# EAGLE schematic L3DCube_16x16_Base_Rev3 (EAGLE 7.2.0)
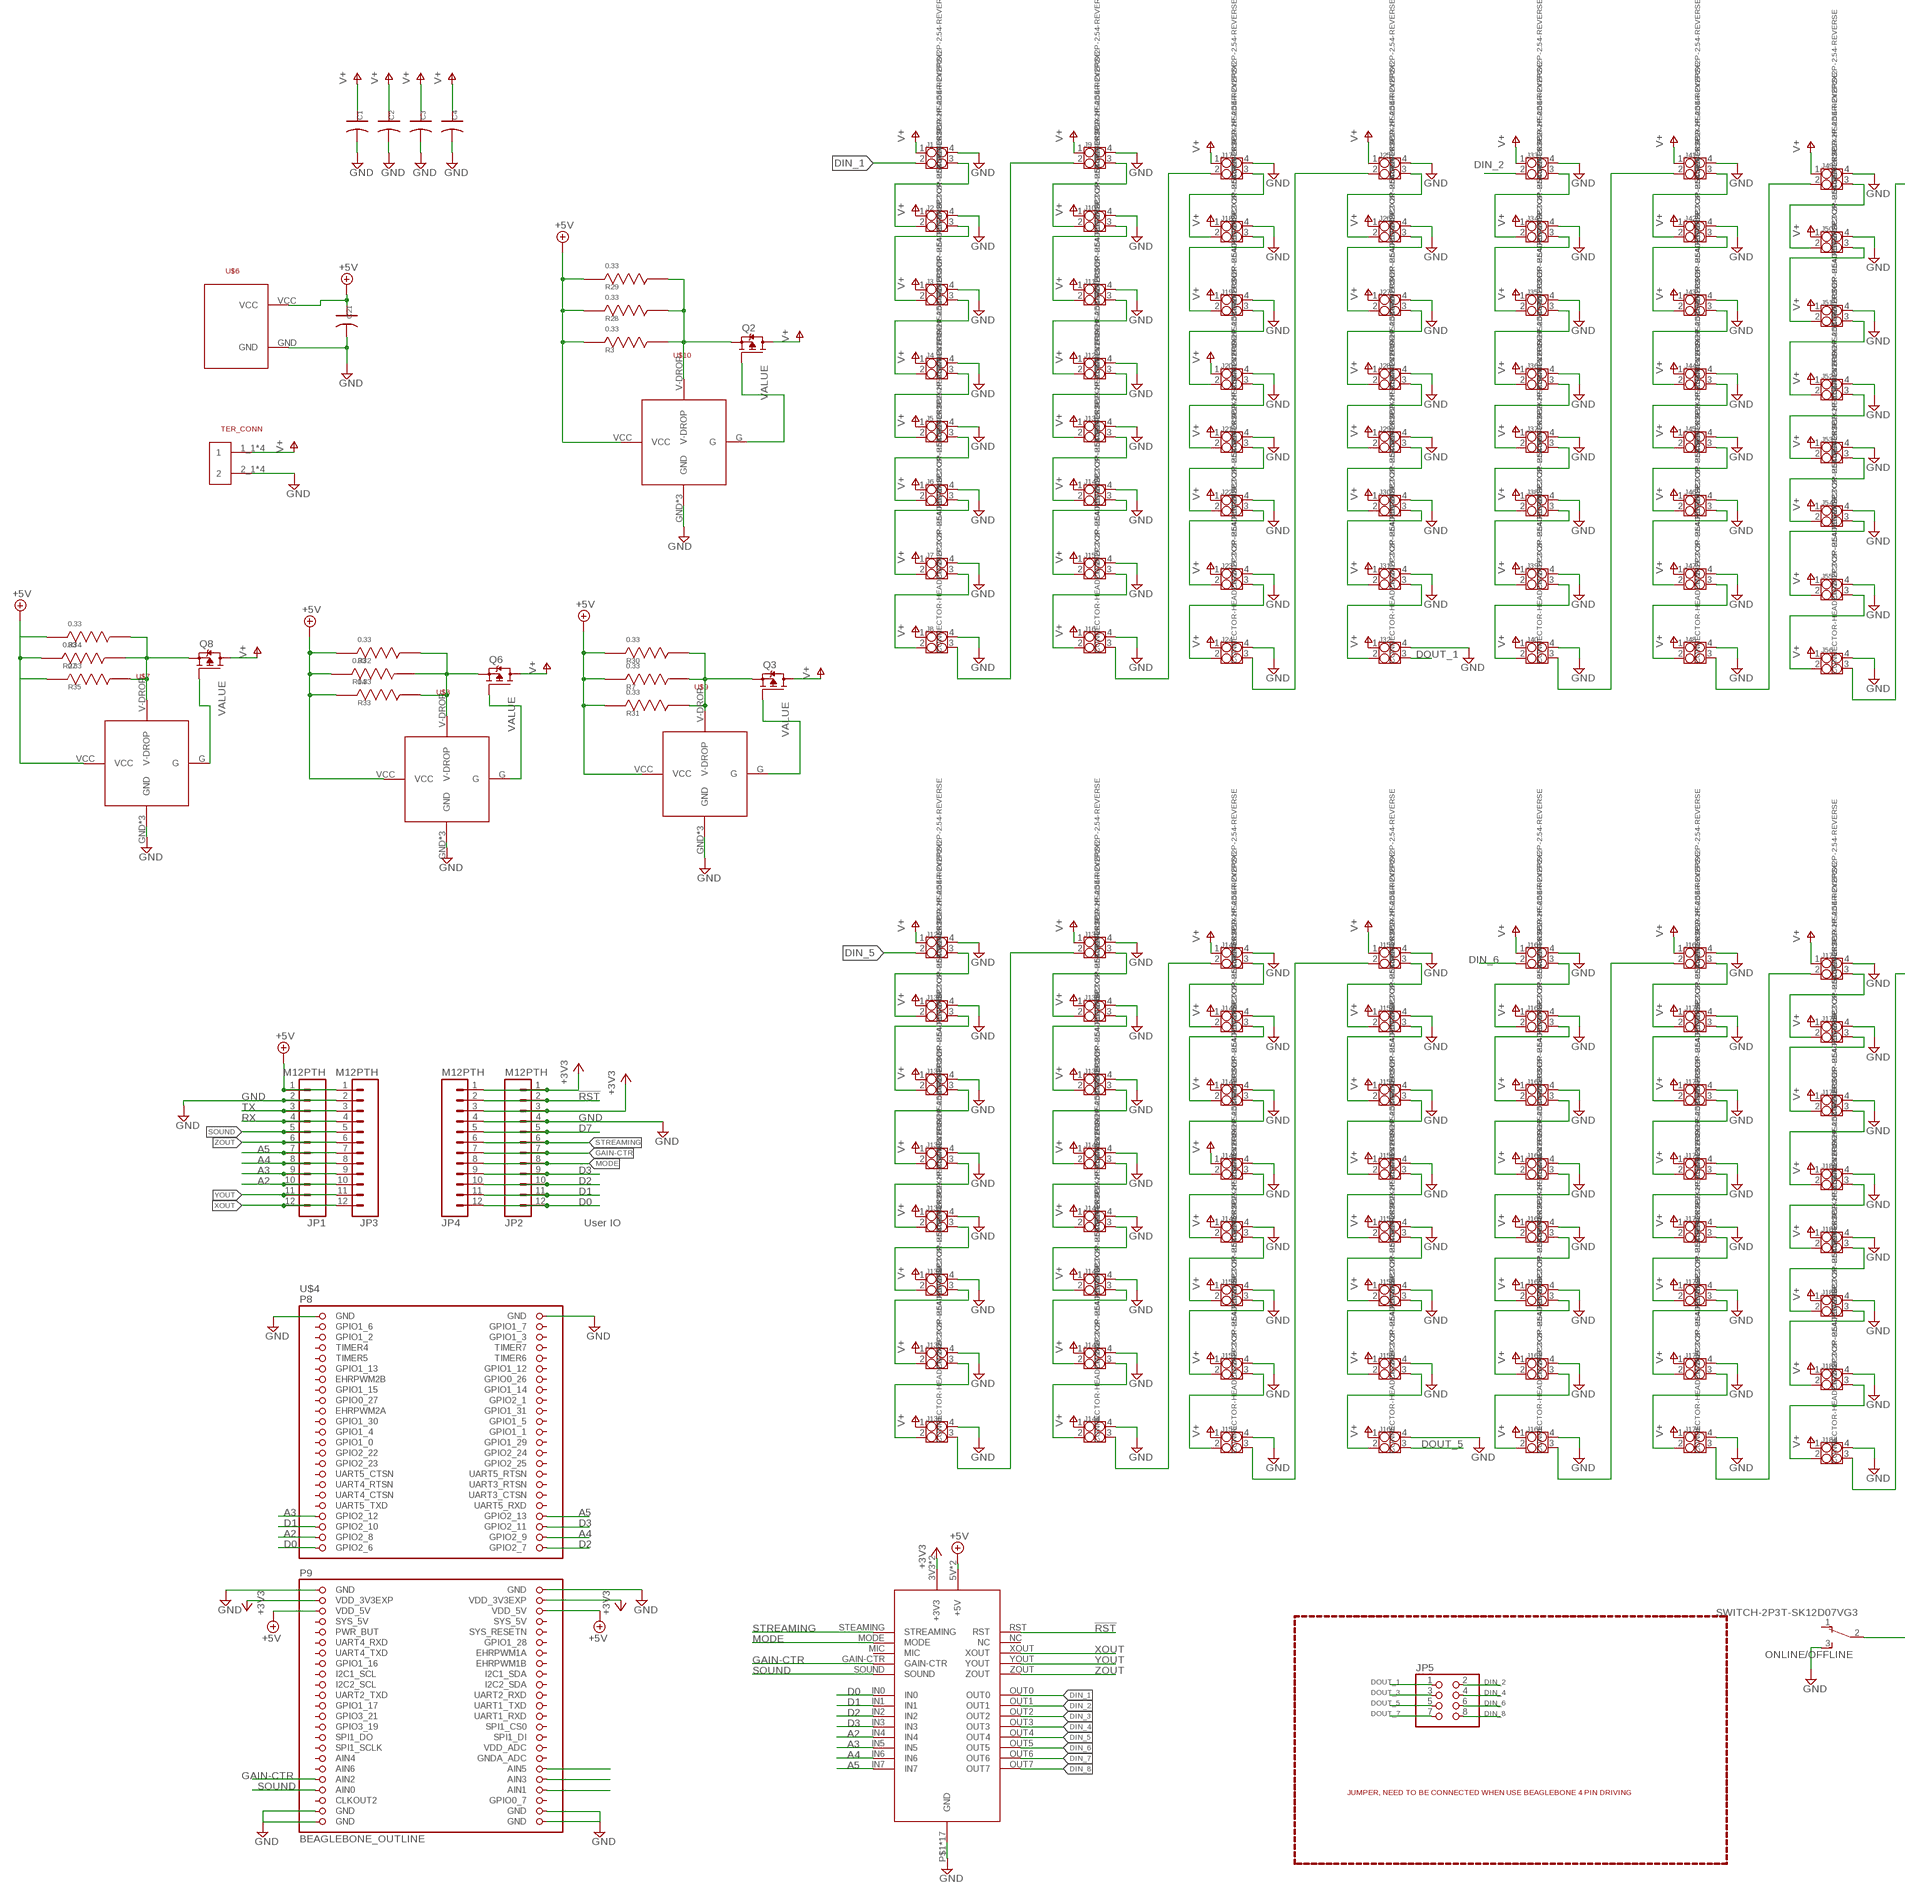
[diagram p0: schematic, sheet 1, part 1 of 2]
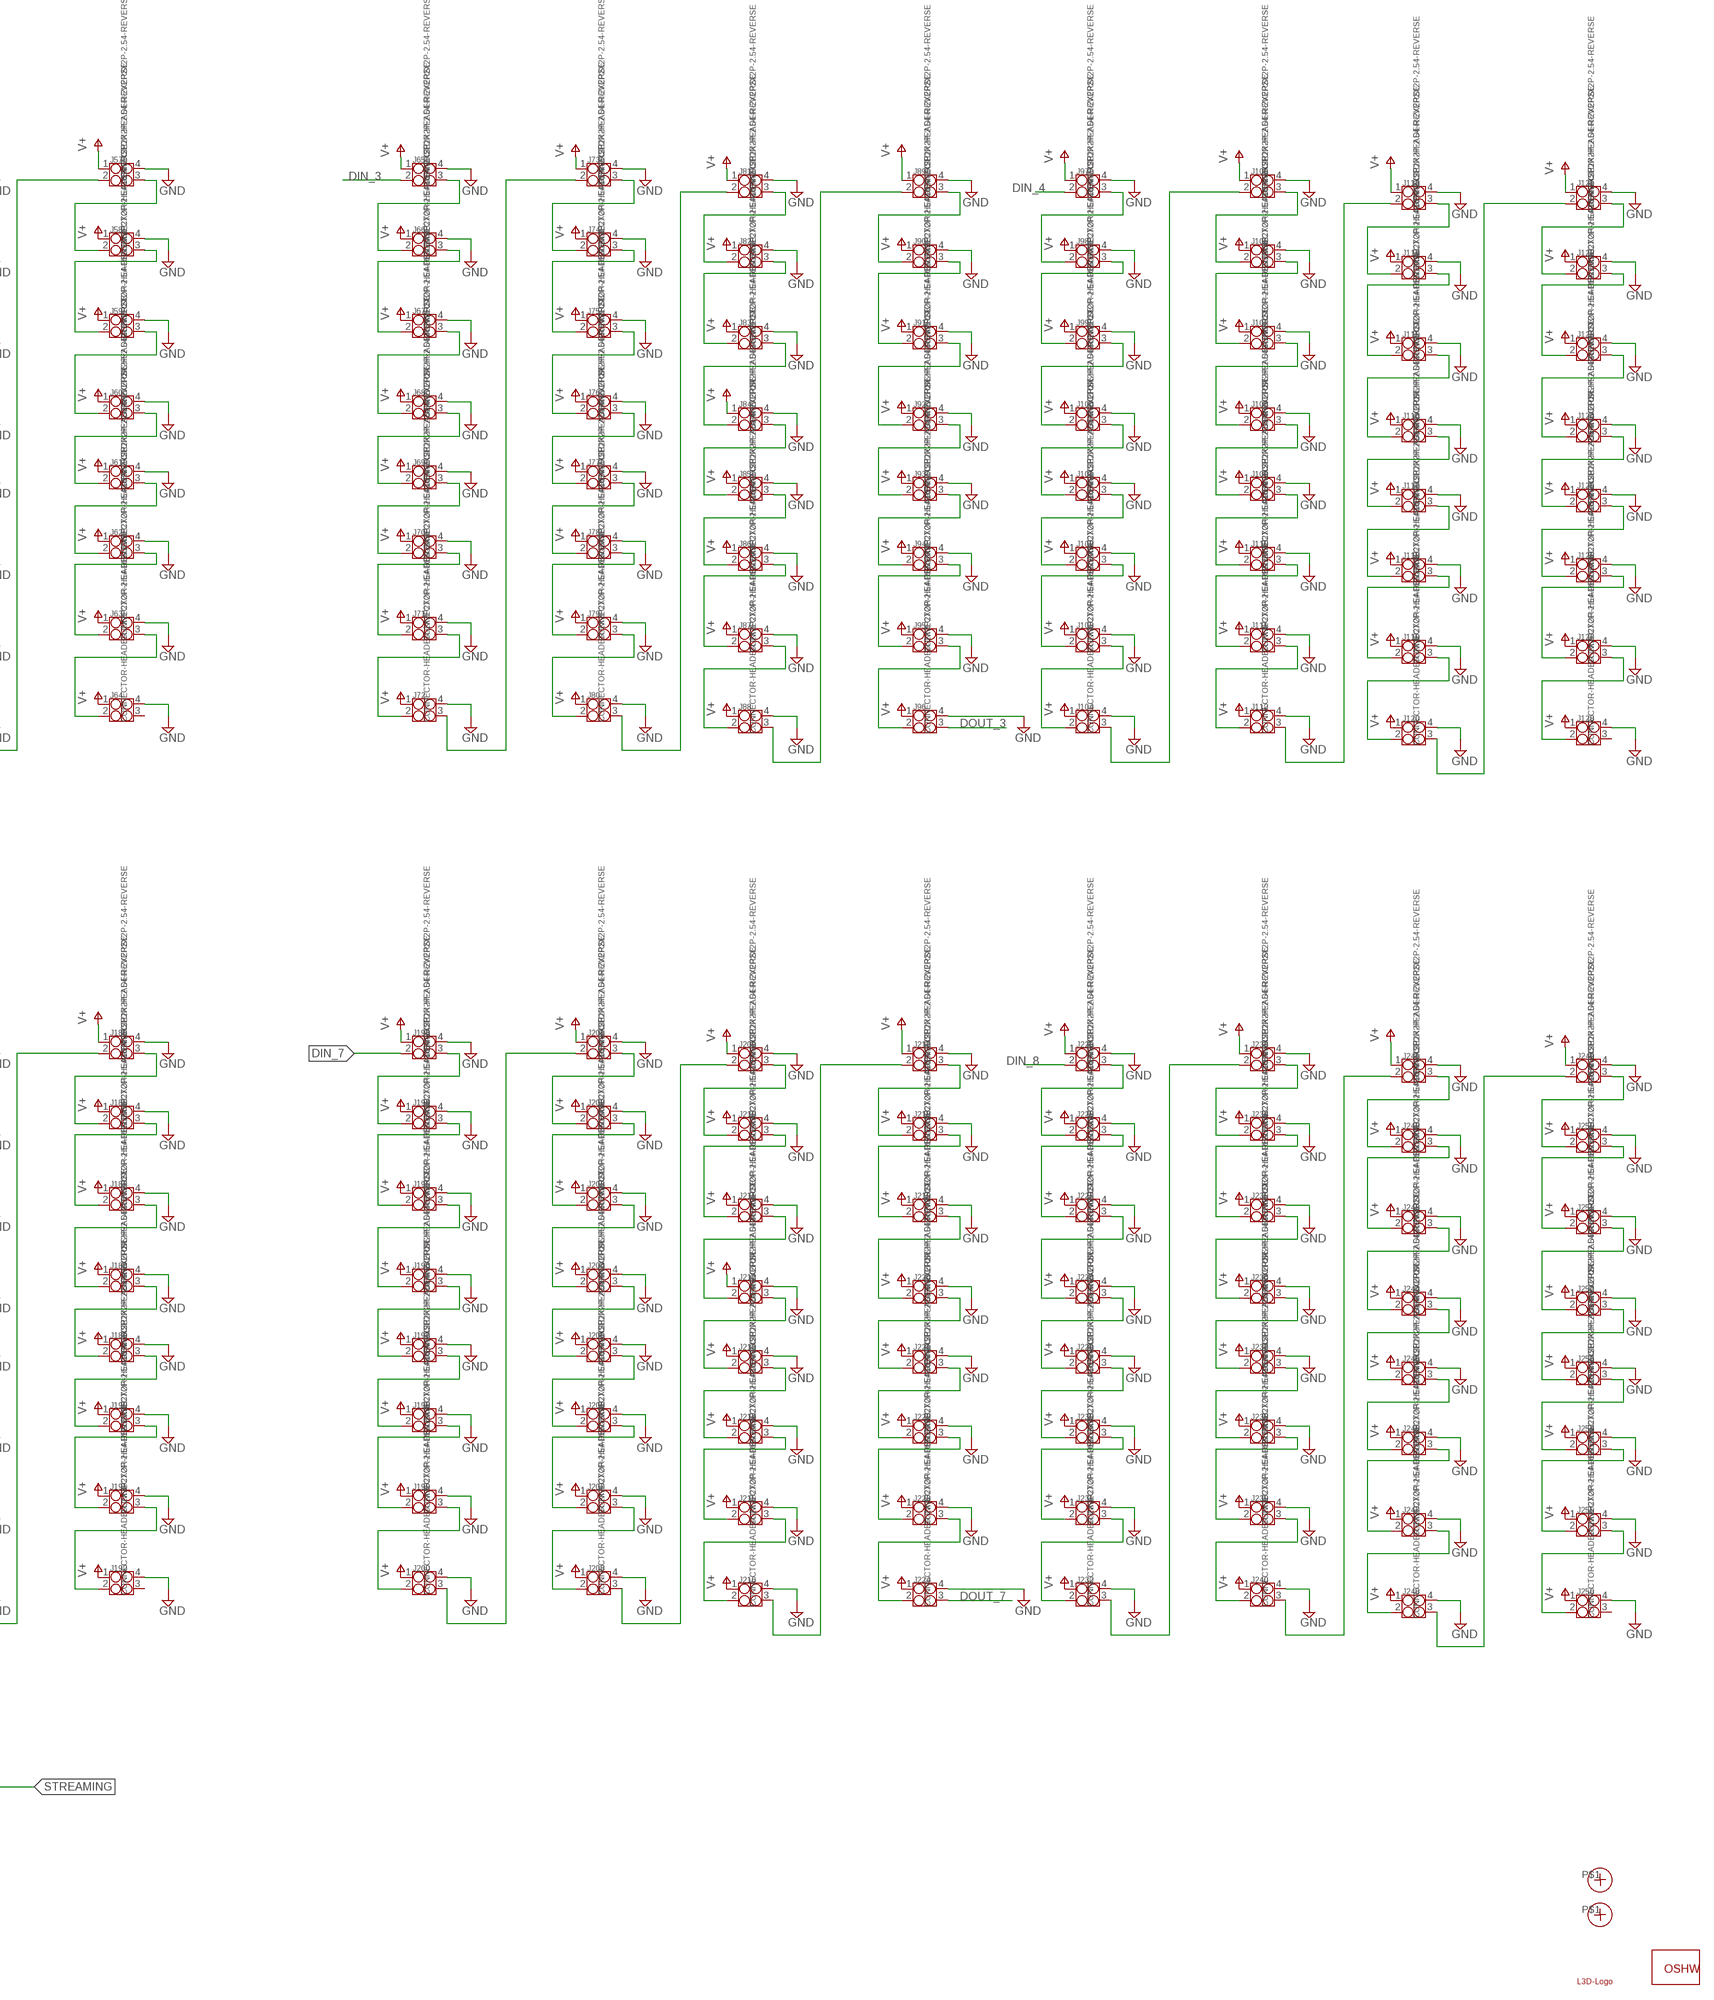
[diagram p1: schematic, sheet 1, part 2 of 2]

## Parts
C1  C-POLAR  [CAPACITOR-E3-8]
C2  C-POLAR  [CAPACITOR-E3-8]
C3  C-POLAR  [CAPACITOR-E3-8]
C4  C-POLAR  [CAPACITOR-E3-8]
C21  C-POLAR  [CAPACITOR-E3-8]
GOLD_ORB_SM1  OSHWLOGO_GOLD_ORB_LG  [OSHW0]
J1  CONNECTOR-HEADER-2X2P2X2P-2.54-REVERSE  [2X2P-2.54-REVERSE]
J2  CONNECTOR-HEADER-2X2P2X2P-2.54-REVERSE  [2X2P-2.54-REVERSE]
J3  CONNECTOR-HEADER-2X2P2X2P-2.54-REVERSE  [2X2P-2.54-REVERSE]
J4  CONNECTOR-HEADER-2X2P2X2P-2.54-REVERSE  [2X2P-2.54-REVERSE]
J5  CONNECTOR-HEADER-2X2P2X2P-2.54-REVERSE  [2X2P-2.54-REVERSE]
J6  CONNECTOR-HEADER-2X2P2X2P-2.54-REVERSE  [2X2P-2.54-REVERSE]
J7  CONNECTOR-HEADER-2X2P2X2P-2.54-REVERSE  [2X2P-2.54-REVERSE]
J8  CONNECTOR-HEADER-2X2P2X2P-2.54-REVERSE  [2X2P-2.54-REVERSE]
J9  CONNECTOR-HEADER-2X2P2X2P-2.54-REVERSE  [2X2P-2.54-REVERSE]
J10  CONNECTOR-HEADER-2X2P2X2P-2.54-REVERSE  [2X2P-2.54-REVERSE]
J11  CONNECTOR-HEADER-2X2P2X2P-2.54-REVERSE  [2X2P-2.54-REVERSE]
J12  CONNECTOR-HEADER-2X2P2X2P-2.54-REVERSE  [2X2P-2.54-REVERSE]
J13  CONNECTOR-HEADER-2X2P2X2P-2.54-REVERSE  [2X2P-2.54-REVERSE]
J14  CONNECTOR-HEADER-2X2P2X2P-2.54-REVERSE  [2X2P-2.54-REVERSE]
J15  CONNECTOR-HEADER-2X2P2X2P-2.54-REVERSE  [2X2P-2.54-REVERSE]
J16  CONNECTOR-HEADER-2X2P2X2P-2.54-REVERSE  [2X2P-2.54-REVERSE]
J17  CONNECTOR-HEADER-2X2P2X2P-2.54-REVERSE  [2X2P-2.54-REVERSE]
J18  CONNECTOR-HEADER-2X2P2X2P-2.54-REVERSE  [2X2P-2.54-REVERSE]
J19  CONNECTOR-HEADER-2X2P2X2P-2.54-REVERSE  [2X2P-2.54-REVERSE]
J20  CONNECTOR-HEADER-2X2P2X2P-2.54-REVERSE  [2X2P-2.54-REVERSE]
J21  CONNECTOR-HEADER-2X2P2X2P-2.54-REVERSE  [2X2P-2.54-REVERSE]
J22  CONNECTOR-HEADER-2X2P2X2P-2.54-REVERSE  [2X2P-2.54-REVERSE]
J23  CONNECTOR-HEADER-2X2P2X2P-2.54-REVERSE  [2X2P-2.54-REVERSE]
J24  CONNECTOR-HEADER-2X2P2X2P-2.54-REVERSE  [2X2P-2.54-REVERSE]
J25  CONNECTOR-HEADER-2X2P2X2P-2.54-REVERSE  [2X2P-2.54-REVERSE]
J26  CONNECTOR-HEADER-2X2P2X2P-2.54-REVERSE  [2X2P-2.54-REVERSE]
J27  CONNECTOR-HEADER-2X2P2X2P-2.54-REVERSE  [2X2P-2.54-REVERSE]
J28  CONNECTOR-HEADER-2X2P2X2P-2.54-REVERSE  [2X2P-2.54-REVERSE]
J29  CONNECTOR-HEADER-2X2P2X2P-2.54-REVERSE  [2X2P-2.54-REVERSE]
J30  CONNECTOR-HEADER-2X2P2X2P-2.54-REVERSE  [2X2P-2.54-REVERSE]
J31  CONNECTOR-HEADER-2X2P2X2P-2.54-REVERSE  [2X2P-2.54-REVERSE]
J32  CONNECTOR-HEADER-2X2P2X2P-2.54-REVERSE  [2X2P-2.54-REVERSE]
J33  CONNECTOR-HEADER-2X2P2X2P-2.54-REVERSE  [2X2P-2.54-REVERSE]
J34  CONNECTOR-HEADER-2X2P2X2P-2.54-REVERSE  [2X2P-2.54-REVERSE]
J35  CONNECTOR-HEADER-2X2P2X2P-2.54-REVERSE  [2X2P-2.54-REVERSE]
J36  CONNECTOR-HEADER-2X2P2X2P-2.54-REVERSE  [2X2P-2.54-REVERSE]
J37  CONNECTOR-HEADER-2X2P2X2P-2.54-REVERSE  [2X2P-2.54-REVERSE]
J38  CONNECTOR-HEADER-2X2P2X2P-2.54-REVERSE  [2X2P-2.54-REVERSE]
J39  CONNECTOR-HEADER-2X2P2X2P-2.54-REVERSE  [2X2P-2.54-REVERSE]
J40  CONNECTOR-HEADER-2X2P2X2P-2.54-REVERSE  [2X2P-2.54-REVERSE]
J41  CONNECTOR-HEADER-2X2P2X2P-2.54-REVERSE  [2X2P-2.54-REVERSE]
J42  CONNECTOR-HEADER-2X2P2X2P-2.54-REVERSE  [2X2P-2.54-REVERSE]
J43  CONNECTOR-HEADER-2X2P2X2P-2.54-REVERSE  [2X2P-2.54-REVERSE]
J44  CONNECTOR-HEADER-2X2P2X2P-2.54-REVERSE  [2X2P-2.54-REVERSE]
J45  CONNECTOR-HEADER-2X2P2X2P-2.54-REVERSE  [2X2P-2.54-REVERSE]
J46  CONNECTOR-HEADER-2X2P2X2P-2.54-REVERSE  [2X2P-2.54-REVERSE]
J47  CONNECTOR-HEADER-2X2P2X2P-2.54-REVERSE  [2X2P-2.54-REVERSE]
J48  CONNECTOR-HEADER-2X2P2X2P-2.54-REVERSE  [2X2P-2.54-REVERSE]
J49  CONNECTOR-HEADER-2X2P2X2P-2.54-REVERSE  [2X2P-2.54-REVERSE]
J50  CONNECTOR-HEADER-2X2P2X2P-2.54-REVERSE  [2X2P-2.54-REVERSE]
J51  CONNECTOR-HEADER-2X2P2X2P-2.54-REVERSE  [2X2P-2.54-REVERSE]
J52  CONNECTOR-HEADER-2X2P2X2P-2.54-REVERSE  [2X2P-2.54-REVERSE]
J53  CONNECTOR-HEADER-2X2P2X2P-2.54-REVERSE  [2X2P-2.54-REVERSE]
J54  CONNECTOR-HEADER-2X2P2X2P-2.54-REVERSE  [2X2P-2.54-REVERSE]
J55  CONNECTOR-HEADER-2X2P2X2P-2.54-REVERSE  [2X2P-2.54-REVERSE]
J56  CONNECTOR-HEADER-2X2P2X2P-2.54-REVERSE  [2X2P-2.54-REVERSE]
J57  CONNECTOR-HEADER-2X2P2X2P-2.54-REVERSE  [2X2P-2.54-REVERSE]
J58  CONNECTOR-HEADER-2X2P2X2P-2.54-REVERSE  [2X2P-2.54-REVERSE]
J59  CONNECTOR-HEADER-2X2P2X2P-2.54-REVERSE  [2X2P-2.54-REVERSE]
J60  CONNECTOR-HEADER-2X2P2X2P-2.54-REVERSE  [2X2P-2.54-REVERSE]
J61  CONNECTOR-HEADER-2X2P2X2P-2.54-REVERSE  [2X2P-2.54-REVERSE]
J62  CONNECTOR-HEADER-2X2P2X2P-2.54-REVERSE  [2X2P-2.54-REVERSE]
J63  CONNECTOR-HEADER-2X2P2X2P-2.54-REVERSE  [2X2P-2.54-REVERSE]
J64  CONNECTOR-HEADER-2X2P2X2P-2.54-REVERSE  [2X2P-2.54-REVERSE]
J65  CONNECTOR-HEADER-2X2P2X2P-2.54-REVERSE  [2X2P-2.54-REVERSE]
J66  CONNECTOR-HEADER-2X2P2X2P-2.54-REVERSE  [2X2P-2.54-REVERSE]
J67  CONNECTOR-HEADER-2X2P2X2P-2.54-REVERSE  [2X2P-2.54-REVERSE]
J68  CONNECTOR-HEADER-2X2P2X2P-2.54-REVERSE  [2X2P-2.54-REVERSE]
J69  CONNECTOR-HEADER-2X2P2X2P-2.54-REVERSE  [2X2P-2.54-REVERSE]
J70  CONNECTOR-HEADER-2X2P2X2P-2.54-REVERSE  [2X2P-2.54-REVERSE]
J71  CONNECTOR-HEADER-2X2P2X2P-2.54-REVERSE  [2X2P-2.54-REVERSE]
J72  CONNECTOR-HEADER-2X2P2X2P-2.54-REVERSE  [2X2P-2.54-REVERSE]
J73  CONNECTOR-HEADER-2X2P2X2P-2.54-REVERSE  [2X2P-2.54-REVERSE]
J74  CONNECTOR-HEADER-2X2P2X2P-2.54-REVERSE  [2X2P-2.54-REVERSE]
J75  CONNECTOR-HEADER-2X2P2X2P-2.54-REVERSE  [2X2P-2.54-REVERSE]
J76  CONNECTOR-HEADER-2X2P2X2P-2.54-REVERSE  [2X2P-2.54-REVERSE]
J77  CONNECTOR-HEADER-2X2P2X2P-2.54-REVERSE  [2X2P-2.54-REVERSE]
J78  CONNECTOR-HEADER-2X2P2X2P-2.54-REVERSE  [2X2P-2.54-REVERSE]
J79  CONNECTOR-HEADER-2X2P2X2P-2.54-REVERSE  [2X2P-2.54-REVERSE]
J80  CONNECTOR-HEADER-2X2P2X2P-2.54-REVERSE  [2X2P-2.54-REVERSE]
J81  CONNECTOR-HEADER-2X2P2X2P-2.54-REVERSE  [2X2P-2.54-REVERSE]
J82  CONNECTOR-HEADER-2X2P2X2P-2.54-REVERSE  [2X2P-2.54-REVERSE]
J83  CONNECTOR-HEADER-2X2P2X2P-2.54-REVERSE  [2X2P-2.54-REVERSE]
J84  CONNECTOR-HEADER-2X2P2X2P-2.54-REVERSE  [2X2P-2.54-REVERSE]
J85  CONNECTOR-HEADER-2X2P2X2P-2.54-REVERSE  [2X2P-2.54-REVERSE]
J86  CONNECTOR-HEADER-2X2P2X2P-2.54-REVERSE  [2X2P-2.54-REVERSE]
J87  CONNECTOR-HEADER-2X2P2X2P-2.54-REVERSE  [2X2P-2.54-REVERSE]
J88  CONNECTOR-HEADER-2X2P2X2P-2.54-REVERSE  [2X2P-2.54-REVERSE]
J89  CONNECTOR-HEADER-2X2P2X2P-2.54-REVERSE  [2X2P-2.54-REVERSE]
J90  CONNECTOR-HEADER-2X2P2X2P-2.54-REVERSE  [2X2P-2.54-REVERSE]
J91  CONNECTOR-HEADER-2X2P2X2P-2.54-REVERSE  [2X2P-2.54-REVERSE]
J92  CONNECTOR-HEADER-2X2P2X2P-2.54-REVERSE  [2X2P-2.54-REVERSE]
J93  CONNECTOR-HEADER-2X2P2X2P-2.54-REVERSE  [2X2P-2.54-REVERSE]
J94  CONNECTOR-HEADER-2X2P2X2P-2.54-REVERSE  [2X2P-2.54-REVERSE]
J95  CONNECTOR-HEADER-2X2P2X2P-2.54-REVERSE  [2X2P-2.54-REVERSE]
J96  CONNECTOR-HEADER-2X2P2X2P-2.54-REVERSE  [2X2P-2.54-REVERSE]
J97  CONNECTOR-HEADER-2X2P2X2P-2.54-REVERSE  [2X2P-2.54-REVERSE]
J98  CONNECTOR-HEADER-2X2P2X2P-2.54-REVERSE  [2X2P-2.54-REVERSE]
J99  CONNECTOR-HEADER-2X2P2X2P-2.54-REVERSE  [2X2P-2.54-REVERSE]
J100  CONNECTOR-HEADER-2X2P2X2P-2.54-REVERSE  [2X2P-2.54-REVERSE]
J101  CONNECTOR-HEADER-2X2P2X2P-2.54-REVERSE  [2X2P-2.54-REVERSE]
J102  CONNECTOR-HEADER-2X2P2X2P-2.54-REVERSE  [2X2P-2.54-REVERSE]
J103  CONNECTOR-HEADER-2X2P2X2P-2.54-REVERSE  [2X2P-2.54-REVERSE]
J104  CONNECTOR-HEADER-2X2P2X2P-2.54-REVERSE  [2X2P-2.54-REVERSE]
J105  CONNECTOR-HEADER-2X2P2X2P-2.54-REVERSE  [2X2P-2.54-REVERSE]
J106  CONNECTOR-HEADER-2X2P2X2P-2.54-REVERSE  [2X2P-2.54-REVERSE]
J107  CONNECTOR-HEADER-2X2P2X2P-2.54-REVERSE  [2X2P-2.54-REVERSE]
J108  CONNECTOR-HEADER-2X2P2X2P-2.54-REVERSE  [2X2P-2.54-REVERSE]
J109  CONNECTOR-HEADER-2X2P2X2P-2.54-REVERSE  [2X2P-2.54-REVERSE]
J110  CONNECTOR-HEADER-2X2P2X2P-2.54-REVERSE  [2X2P-2.54-REVERSE]
J111  CONNECTOR-HEADER-2X2P2X2P-2.54-REVERSE  [2X2P-2.54-REVERSE]
J112  CONNECTOR-HEADER-2X2P2X2P-2.54-REVERSE  [2X2P-2.54-REVERSE]
J113  CONNECTOR-HEADER-2X2P2X2P-2.54-REVERSE  [2X2P-2.54-REVERSE]
J114  CONNECTOR-HEADER-2X2P2X2P-2.54-REVERSE  [2X2P-2.54-REVERSE]
J115  CONNECTOR-HEADER-2X2P2X2P-2.54-REVERSE  [2X2P-2.54-REVERSE]
J116  CONNECTOR-HEADER-2X2P2X2P-2.54-REVERSE  [2X2P-2.54-REVERSE]
J117  CONNECTOR-HEADER-2X2P2X2P-2.54-REVERSE  [2X2P-2.54-REVERSE]
J118  CONNECTOR-HEADER-2X2P2X2P-2.54-REVERSE  [2X2P-2.54-REVERSE]
J119  CONNECTOR-HEADER-2X2P2X2P-2.54-REVERSE  [2X2P-2.54-REVERSE]
J120  CONNECTOR-HEADER-2X2P2X2P-2.54-REVERSE  [2X2P-2.54-REVERSE]
J121  CONNECTOR-HEADER-2X2P2X2P-2.54-REVERSE  [2X2P-2.54-REVERSE]
J122  CONNECTOR-HEADER-2X2P2X2P-2.54-REVERSE  [2X2P-2.54-REVERSE]
J123  CONNECTOR-HEADER-2X2P2X2P-2.54-REVERSE  [2X2P-2.54-REVERSE]
J124  CONNECTOR-HEADER-2X2P2X2P-2.54-REVERSE  [2X2P-2.54-REVERSE]
J125  CONNECTOR-HEADER-2X2P2X2P-2.54-REVERSE  [2X2P-2.54-REVERSE]
J126  CONNECTOR-HEADER-2X2P2X2P-2.54-REVERSE  [2X2P-2.54-REVERSE]
J127  CONNECTOR-HEADER-2X2P2X2P-2.54-REVERSE  [2X2P-2.54-REVERSE]
J128  CONNECTOR-HEADER-2X2P2X2P-2.54-REVERSE  [2X2P-2.54-REVERSE]
J129  CONNECTOR-HEADER-2X2P2X2P-2.54-REVERSE  [2X2P-2.54-REVERSE]
J130  CONNECTOR-HEADER-2X2P2X2P-2.54-REVERSE  [2X2P-2.54-REVERSE]
J131  CONNECTOR-HEADER-2X2P2X2P-2.54-REVERSE  [2X2P-2.54-REVERSE]
J132  CONNECTOR-HEADER-2X2P2X2P-2.54-REVERSE  [2X2P-2.54-REVERSE]
J133  CONNECTOR-HEADER-2X2P2X2P-2.54-REVERSE  [2X2P-2.54-REVERSE]
J134  CONNECTOR-HEADER-2X2P2X2P-2.54-REVERSE  [2X2P-2.54-REVERSE]
J135  CONNECTOR-HEADER-2X2P2X2P-2.54-REVERSE  [2X2P-2.54-REVERSE]
J136  CONNECTOR-HEADER-2X2P2X2P-2.54-REVERSE  [2X2P-2.54-REVERSE]
J137  CONNECTOR-HEADER-2X2P2X2P-2.54-REVERSE  [2X2P-2.54-REVERSE]
J138  CONNECTOR-HEADER-2X2P2X2P-2.54-REVERSE  [2X2P-2.54-REVERSE]
J139  CONNECTOR-HEADER-2X2P2X2P-2.54-REVERSE  [2X2P-2.54-REVERSE]
J140  CONNECTOR-HEADER-2X2P2X2P-2.54-REVERSE  [2X2P-2.54-REVERSE]
J141  CONNECTOR-HEADER-2X2P2X2P-2.54-REVERSE  [2X2P-2.54-REVERSE]
J142  CONNECTOR-HEADER-2X2P2X2P-2.54-REVERSE  [2X2P-2.54-REVERSE]
J143  CONNECTOR-HEADER-2X2P2X2P-2.54-REVERSE  [2X2P-2.54-REVERSE]
J144  CONNECTOR-HEADER-2X2P2X2P-2.54-REVERSE  [2X2P-2.54-REVERSE]
J145  CONNECTOR-HEADER-2X2P2X2P-2.54-REVERSE  [2X2P-2.54-REVERSE]
J146  CONNECTOR-HEADER-2X2P2X2P-2.54-REVERSE  [2X2P-2.54-REVERSE]
J147  CONNECTOR-HEADER-2X2P2X2P-2.54-REVERSE  [2X2P-2.54-REVERSE]
J148  CONNECTOR-HEADER-2X2P2X2P-2.54-REVERSE  [2X2P-2.54-REVERSE]
J149  CONNECTOR-HEADER-2X2P2X2P-2.54-REVERSE  [2X2P-2.54-REVERSE]
J150  CONNECTOR-HEADER-2X2P2X2P-2.54-REVERSE  [2X2P-2.54-REVERSE]
J151  CONNECTOR-HEADER-2X2P2X2P-2.54-REVERSE  [2X2P-2.54-REVERSE]
J152  CONNECTOR-HEADER-2X2P2X2P-2.54-REVERSE  [2X2P-2.54-REVERSE]
J153  CONNECTOR-HEADER-2X2P2X2P-2.54-REVERSE  [2X2P-2.54-REVERSE]
J154  CONNECTOR-HEADER-2X2P2X2P-2.54-REVERSE  [2X2P-2.54-REVERSE]
J155  CONNECTOR-HEADER-2X2P2X2P-2.54-REVERSE  [2X2P-2.54-REVERSE]
J156  CONNECTOR-HEADER-2X2P2X2P-2.54-REVERSE  [2X2P-2.54-REVERSE]
J157  CONNECTOR-HEADER-2X2P2X2P-2.54-REVERSE  [2X2P-2.54-REVERSE]
J158  CONNECTOR-HEADER-2X2P2X2P-2.54-REVERSE  [2X2P-2.54-REVERSE]
J159  CONNECTOR-HEADER-2X2P2X2P-2.54-REVERSE  [2X2P-2.54-REVERSE]
J160  CONNECTOR-HEADER-2X2P2X2P-2.54-REVERSE  [2X2P-2.54-REVERSE]
J161  CONNECTOR-HEADER-2X2P2X2P-2.54-REVERSE  [2X2P-2.54-REVERSE]
J162  CONNECTOR-HEADER-2X2P2X2P-2.54-REVERSE  [2X2P-2.54-REVERSE]
J163  CONNECTOR-HEADER-2X2P2X2P-2.54-REVERSE  [2X2P-2.54-REVERSE]
J164  CONNECTOR-HEADER-2X2P2X2P-2.54-REVERSE  [2X2P-2.54-REVERSE]
J165  CONNECTOR-HEADER-2X2P2X2P-2.54-REVERSE  [2X2P-2.54-REVERSE]
J166  CONNECTOR-HEADER-2X2P2X2P-2.54-REVERSE  [2X2P-2.54-REVERSE]
J167  CONNECTOR-HEADER-2X2P2X2P-2.54-REVERSE  [2X2P-2.54-REVERSE]
J168  CONNECTOR-HEADER-2X2P2X2P-2.54-REVERSE  [2X2P-2.54-REVERSE]
J169  CONNECTOR-HEADER-2X2P2X2P-2.54-REVERSE  [2X2P-2.54-REVERSE]
J170  CONNECTOR-HEADER-2X2P2X2P-2.54-REVERSE  [2X2P-2.54-REVERSE]
J171  CONNECTOR-HEADER-2X2P2X2P-2.54-REVERSE  [2X2P-2.54-REVERSE]
J172  CONNECTOR-HEADER-2X2P2X2P-2.54-REVERSE  [2X2P-2.54-REVERSE]
J173  CONNECTOR-HEADER-2X2P2X2P-2.54-REVERSE  [2X2P-2.54-REVERSE]
J174  CONNECTOR-HEADER-2X2P2X2P-2.54-REVERSE  [2X2P-2.54-REVERSE]
J175  CONNECTOR-HEADER-2X2P2X2P-2.54-REVERSE  [2X2P-2.54-REVERSE]
J176  CONNECTOR-HEADER-2X2P2X2P-2.54-REVERSE  [2X2P-2.54-REVERSE]
J177  CONNECTOR-HEADER-2X2P2X2P-2.54-REVERSE  [2X2P-2.54-REVERSE]
J178  CONNECTOR-HEADER-2X2P2X2P-2.54-REVERSE  [2X2P-2.54-REVERSE]
J179  CONNECTOR-HEADER-2X2P2X2P-2.54-REVERSE  [2X2P-2.54-REVERSE]
J180  CONNECTOR-HEADER-2X2P2X2P-2.54-REVERSE  [2X2P-2.54-REVERSE]
J181  CONNECTOR-HEADER-2X2P2X2P-2.54-REVERSE  [2X2P-2.54-REVERSE]
J182  CONNECTOR-HEADER-2X2P2X2P-2.54-REVERSE  [2X2P-2.54-REVERSE]
J183  CONNECTOR-HEADER-2X2P2X2P-2.54-REVERSE  [2X2P-2.54-REVERSE]
J184  CONNECTOR-HEADER-2X2P2X2P-2.54-REVERSE  [2X2P-2.54-REVERSE]
J185  CONNECTOR-HEADER-2X2P2X2P-2.54-REVERSE  [2X2P-2.54-REVERSE]
J186  CONNECTOR-HEADER-2X2P2X2P-2.54-REVERSE  [2X2P-2.54-REVERSE]
J187  CONNECTOR-HEADER-2X2P2X2P-2.54-REVERSE  [2X2P-2.54-REVERSE]
J188  CONNECTOR-HEADER-2X2P2X2P-2.54-REVERSE  [2X2P-2.54-REVERSE]
J189  CONNECTOR-HEADER-2X2P2X2P-2.54-REVERSE  [2X2P-2.54-REVERSE]
J190  CONNECTOR-HEADER-2X2P2X2P-2.54-REVERSE  [2X2P-2.54-REVERSE]
J191  CONNECTOR-HEADER-2X2P2X2P-2.54-REVERSE  [2X2P-2.54-REVERSE]
J192  CONNECTOR-HEADER-2X2P2X2P-2.54-REVERSE  [2X2P-2.54-REVERSE]
J193  CONNECTOR-HEADER-2X2P2X2P-2.54-REVERSE  [2X2P-2.54-REVERSE]
J194  CONNECTOR-HEADER-2X2P2X2P-2.54-REVERSE  [2X2P-2.54-REVERSE]
J195  CONNECTOR-HEADER-2X2P2X2P-2.54-REVERSE  [2X2P-2.54-REVERSE]
J196  CONNECTOR-HEADER-2X2P2X2P-2.54-REVERSE  [2X2P-2.54-REVERSE]
J197  CONNECTOR-HEADER-2X2P2X2P-2.54-REVERSE  [2X2P-2.54-REVERSE]
J198  CONNECTOR-HEADER-2X2P2X2P-2.54-REVERSE  [2X2P-2.54-REVERSE]
J199  CONNECTOR-HEADER-2X2P2X2P-2.54-REVERSE  [2X2P-2.54-REVERSE]
J200  CONNECTOR-HEADER-2X2P2X2P-2.54-REVERSE  [2X2P-2.54-REVERSE]
J201  CONNECTOR-HEADER-2X2P2X2P-2.54-REVERSE  [2X2P-2.54-REVERSE]
J202  CONNECTOR-HEADER-2X2P2X2P-2.54-REVERSE  [2X2P-2.54-REVERSE]
J203  CONNECTOR-HEADER-2X2P2X2P-2.54-REVERSE  [2X2P-2.54-REVERSE]
J204  CONNECTOR-HEADER-2X2P2X2P-2.54-REVERSE  [2X2P-2.54-REVERSE]
J205  CONNECTOR-HEADER-2X2P2X2P-2.54-REVERSE  [2X2P-2.54-REVERSE]
J206  CONNECTOR-HEADER-2X2P2X2P-2.54-REVERSE  [2X2P-2.54-REVERSE]
J207  CONNECTOR-HEADER-2X2P2X2P-2.54-REVERSE  [2X2P-2.54-REVERSE]
J208  CONNECTOR-HEADER-2X2P2X2P-2.54-REVERSE  [2X2P-2.54-REVERSE]
J209  CONNECTOR-HEADER-2X2P2X2P-2.54-REVERSE  [2X2P-2.54-REVERSE]
J210  CONNECTOR-HEADER-2X2P2X2P-2.54-REVERSE  [2X2P-2.54-REVERSE]
J211  CONNECTOR-HEADER-2X2P2X2P-2.54-REVERSE  [2X2P-2.54-REVERSE]
J212  CONNECTOR-HEADER-2X2P2X2P-2.54-REVERSE  [2X2P-2.54-REVERSE]
J213  CONNECTOR-HEADER-2X2P2X2P-2.54-REVERSE  [2X2P-2.54-REVERSE]
J214  CONNECTOR-HEADER-2X2P2X2P-2.54-REVERSE  [2X2P-2.54-REVERSE]
J215  CONNECTOR-HEADER-2X2P2X2P-2.54-REVERSE  [2X2P-2.54-REVERSE]
J216  CONNECTOR-HEADER-2X2P2X2P-2.54-REVERSE  [2X2P-2.54-REVERSE]
J217  CONNECTOR-HEADER-2X2P2X2P-2.54-REVERSE  [2X2P-2.54-REVERSE]
J218  CONNECTOR-HEADER-2X2P2X2P-2.54-REVERSE  [2X2P-2.54-REVERSE]
J219  CONNECTOR-HEADER-2X2P2X2P-2.54-REVERSE  [2X2P-2.54-REVERSE]
J220  CONNECTOR-HEADER-2X2P2X2P-2.54-REVERSE  [2X2P-2.54-REVERSE]
J221  CONNECTOR-HEADER-2X2P2X2P-2.54-REVERSE  [2X2P-2.54-REVERSE]
J222  CONNECTOR-HEADER-2X2P2X2P-2.54-REVERSE  [2X2P-2.54-REVERSE]
J223  CONNECTOR-HEADER-2X2P2X2P-2.54-REVERSE  [2X2P-2.54-REVERSE]
J224  CONNECTOR-HEADER-2X2P2X2P-2.54-REVERSE  [2X2P-2.54-REVERSE]
J225  CONNECTOR-HEADER-2X2P2X2P-2.54-REVERSE  [2X2P-2.54-REVERSE]
J226  CONNECTOR-HEADER-2X2P2X2P-2.54-REVERSE  [2X2P-2.54-REVERSE]
J227  CONNECTOR-HEADER-2X2P2X2P-2.54-REVERSE  [2X2P-2.54-REVERSE]
J228  CONNECTOR-HEADER-2X2P2X2P-2.54-REVERSE  [2X2P-2.54-REVERSE]
J229  CONNECTOR-HEADER-2X2P2X2P-2.54-REVERSE  [2X2P-2.54-REVERSE]
J230  CONNECTOR-HEADER-2X2P2X2P-2.54-REVERSE  [2X2P-2.54-REVERSE]
J231  CONNECTOR-HEADER-2X2P2X2P-2.54-REVERSE  [2X2P-2.54-REVERSE]
J232  CONNECTOR-HEADER-2X2P2X2P-2.54-REVERSE  [2X2P-2.54-REVERSE]
J233  CONNECTOR-HEADER-2X2P2X2P-2.54-REVERSE  [2X2P-2.54-REVERSE]
J234  CONNECTOR-HEADER-2X2P2X2P-2.54-REVERSE  [2X2P-2.54-REVERSE]
J235  CONNECTOR-HEADER-2X2P2X2P-2.54-REVERSE  [2X2P-2.54-REVERSE]
J236  CONNECTOR-HEADER-2X2P2X2P-2.54-REVERSE  [2X2P-2.54-REVERSE]
J237  CONNECTOR-HEADER-2X2P2X2P-2.54-REVERSE  [2X2P-2.54-REVERSE]
J238  CONNECTOR-HEADER-2X2P2X2P-2.54-REVERSE  [2X2P-2.54-REVERSE]
J239  CONNECTOR-HEADER-2X2P2X2P-2.54-REVERSE  [2X2P-2.54-REVERSE]
J240  CONNECTOR-HEADER-2X2P2X2P-2.54-REVERSE  [2X2P-2.54-REVERSE]
J241  CONNECTOR-HEADER-2X2P2X2P-2.54-REVERSE  [2X2P-2.54-REVERSE]
J242  CONNECTOR-HEADER-2X2P2X2P-2.54-REVERSE  [2X2P-2.54-REVERSE]
J243  CONNECTOR-HEADER-2X2P2X2P-2.54-REVERSE  [2X2P-2.54-REVERSE]
J244  CONNECTOR-HEADER-2X2P2X2P-2.54-REVERSE  [2X2P-2.54-REVERSE]
J245  CONNECTOR-HEADER-2X2P2X2P-2.54-REVERSE  [2X2P-2.54-REVERSE]
J246  CONNECTOR-HEADER-2X2P2X2P-2.54-REVERSE  [2X2P-2.54-REVERSE]
J247  CONNECTOR-HEADER-2X2P2X2P-2.54-REVERSE  [2X2P-2.54-REVERSE]
J248  CONNECTOR-HEADER-2X2P2X2P-2.54-REVERSE  [2X2P-2.54-REVERSE]
J249  CONNECTOR-HEADER-2X2P2X2P-2.54-REVERSE  [2X2P-2.54-REVERSE]
J250  CONNECTOR-HEADER-2X2P2X2P-2.54-REVERSE  [2X2P-2.54-REVERSE]
J251  CONNECTOR-HEADER-2X2P2X2P-2.54-REVERSE  [2X2P-2.54-REVERSE]
J252  CONNECTOR-HEADER-2X2P2X2P-2.54-REVERSE  [2X2P-2.54-REVERSE]
J253  CONNECTOR-HEADER-2X2P2X2P-2.54-REVERSE  [2X2P-2.54-REVERSE]
J254  CONNECTOR-HEADER-2X2P2X2P-2.54-REVERSE  [2X2P-2.54-REVERSE]
J255  CONNECTOR-HEADER-2X2P2X2P-2.54-REVERSE  [2X2P-2.54-REVERSE]
J256  CONNECTOR-HEADER-2X2P2X2P-2.54-REVERSE  [2X2P-2.54-REVERSE]
JP1  M12PTH  [1X12-SMALL-PADS]
JP2  M12PTH  [1X12-SMALL-PADS]
JP3  M12PTH  [1X12-SMALL-PADS]
JP4  M12PTH  [1X12-SMALL-PADS]
JP5  PINHD-2X4  [2X04]
ONLINE/OFFLINE  SWITCH-2P3T-SK12D07VG3  [SWITCH-2P3T-SK12D07VG3]
Q2  FDD6637  FDD4141TO252  [TO252]
Q3  FDD6637  FDD4141TO252  [TO252]
Q6  FDD6637  FDD4141TO252  [TO252]
Q8  FDD6637  FDD4141TO252  [TO252]
R3  0.33  RESISTOR-3W-20MM  [RESISTOR-3W-20MM]
R7  0.33  RESISTOR-3W-20MM  [RESISTOR-3W-20MM]
R14  0.33  RESISTOR-3W-20MM  [RESISTOR-3W-20MM]
R27  0.33  RESISTOR-3W-20MM  [RESISTOR-3W-20MM]
R28  0.33  RESISTOR-3W-20MM  [RESISTOR-3W-20MM]
R29  0.33  RESISTOR-3W-20MM  [RESISTOR-3W-20MM]
R30  0.33  RESISTOR-3W-20MM  [RESISTOR-3W-20MM]
R31  0.33  RESISTOR-3W-20MM  [RESISTOR-3W-20MM]
R32  0.33  RESISTOR-3W-20MM  [RESISTOR-3W-20MM]
R33  0.33  RESISTOR-3W-20MM  [RESISTOR-3W-20MM]
R34  0.33  RESISTOR-3W-20MM  [RESISTOR-3W-20MM]
R35  0.33  RESISTOR-3W-20MM  [RESISTOR-3W-20MM]
TER_CONN  TERMINAL_CONN  [TERMINALCONNECTOR_15MM]
U$1  L3D-LOGOL3DCUBE-LOGO-0.8X2.5  [L3DCUBE-LOGO-0.8X2.5]
U$2  FIDUCIAL-MARK  [FIDUCIAL-MARK]
U$3  FIDUCIAL-MARK  [FIDUCIAL-MARK]
U$4  BEAGLEBONE_OUTLINE  [BEAGLEBONE_SHIELD]
U$5  CUBE-16-DAUGHTERBOARD-SOLDERPAD  [CUBE-16-DAUGHTERBOARD-PAD]
U$6  CONNECTOR-1X2P-POWER-PAD  [1X2P-POWER-PAD]
U$7  CUBE-16-DAUGHTERBOARD-CURRENT-LMTPAD  [CUBE-16-DAUGHTERBOARD-CURRENT-LMT-PAD]
U$8  CUBE-16-DAUGHTERBOARD-CURRENT-LMTPAD  [CUBE-16-DAUGHTERBOARD-CURRENT-LMT-PAD]
U$9  CUBE-16-DAUGHTERBOARD-CURRENT-LMTPAD  [CUBE-16-DAUGHTERBOARD-CURRENT-LMT-PAD]
U$10  CUBE-16-DAUGHTERBOARD-CURRENT-LMTPAD  [CUBE-16-DAUGHTERBOARD-CURRENT-LMT-PAD]

## Nets
!RST: JP2.2 JP4.2 U$5.RST
+3V3: JP2.1 JP2.3 JP4.1 JP4.3 U$4.49(VDD_3V3EXP) U$4.50(VDD_3V3EXP) U$5.3V3'(+3V3) U$5.3V3(+3V3)
+5V: C21.+ JP1.1 JP3.1 R3.1 R7.1 R14.1 R27.1 R28.1 R29.1 R30.1 R31.1 R32.1 R33.1 R34.1 R35.1 U$4.51(VDD_5V) U$4.52(VDD_5V) U$5.5V'(+5V) U$5.5V(+5V) U$6.VCC U$7.VCC U$8.VCC U$9.VCC U$10.VCC
A2: JP1.10 JP3.10 U$4.43(GPIO2_8) U$5.IN4
A3: JP1.9 JP3.9 U$4.39(GPIO2_12) U$5.IN5
A4: JP1.8 JP3.8 U$4.44(GPIO2_9) U$5.IN6
A5: JP1.7 JP3.7 U$4.40(GPIO2_13) U$5.IN7
D0: JP2.12 JP4.12 U$4.45(GPIO2_6) U$5.IN0
D1: JP2.11 JP4.11 U$4.41(GPIO2_10) U$5.IN1
D2: JP2.10 JP4.10 U$4.46(GPIO2_7) U$5.IN2
D3: JP2.9 JP4.9 U$4.42(GPIO2_11) U$5.IN3
D7: JP2.5 JP4.5
DIN_1: J1.2 U$5.OUT0
DIN_2: J33.2 JP5.2 U$5.OUT1
DIN_3: J65.2 U$5.OUT2
DIN_4: J97.2 JP5.4 U$5.OUT3
DIN_5: J129.2 U$5.OUT4
DIN_6: J161.2 JP5.6 U$5.OUT5
DIN_7: J193.2 U$5.OUT6
DIN_8: J225.2 JP5.8 U$5.OUT7
DOUT_1: J32.3 JP5.1
DOUT_3: J96.3 JP5.3
DOUT_5: J160.3 JP5.5
DOUT_7: J224.3 JP5.7
GAIN-CTR: JP2.7 JP4.7 U$4.83(AIN2) U$5.GAIN-CTR
GND: C1.- C2.- C3.- C4.- C21.- J1.4 J2.4 J3.4 J4.4 J5.4 J6.4 J7.4 J8.4 J9.4 J10.4 J11.4 J12.4 J13.4 J14.4 J15.4 J16.4 J17.4 J18.4 J19.4 J20.4 J21.4 J22.4 J23.4 J24.4 J25.4 J26.4 J27.4 J28.4 J29.4 J30.4 J31.4 J32.4 J33.4 J34.4 J35.4 J36.4 J37.4 J38.4 J39.4 J40.4 J41.4 J42.4 J43.4 J44.4 J45.4 J46.4 J47.4 J48.4 J49.4 J50.4 J51.4 J52.4 J53.4 J54.4 J55.4 J56.4 J57.4 J58.4 J59.4 J60.4 J61.4 J62.4 J63.4 J64.4 J65.4 J66.4 J67.4 J68.4 J69.4 J70.4 J71.4 J72.4 J73.4 J74.4 J75.4 J76.4 J77.4 J78.4 J79.4 J80.4 J81.4 J82.4 J83.4 J84.4 J85.4 J86.4 J87.4 J88.4 J89.4 J90.4 J91.4 J92.4 J93.4 J94.4 J95.4 J96.4 J97.4 J98.4 J99.4 J100.4 J101.4 J102.4 J103.4 J104.4 J105.4 J106.4 J107.4 J108.4 J109.4 J110.4 J111.4 J112.4 J113.4 J114.4 J115.4 J116.4 J117.4 J118.4 J119.4 J120.4 J121.4 J122.4 J123.4 J124.4 J125.4 J126.4 J127.4 J128.4 J129.4 J130.4 J131.4 J132.4 J133.4 J134.4 J135.4 J136.4 J137.4 J138.4 J139.4 J140.4 J141.4 J142.4 J143.4 J144.4 J145.4 J146.4 J147.4 J148.4 J149.4 J150.4 J151.4 J152.4 J153.4 J154.4 J155.4 J156.4 J157.4 J158.4 J159.4 J160.4 J161.4 J162.4 J163.4 J164.4 J165.4 J166.4 J167.4 J168.4 J169.4 J170.4 J171.4 J172.4 J173.4 J174.4 J175.4 J176.4 J177.4 J178.4 J179.4 J180.4 J181.4 J182.4 J183.4 J184.4 J185.4 J186.4 J187.4 J188.4 J189.4 J190.4 J191.4 J192.4 J193.4 J194.4 J195.4 J196.4 J197.4 J198.4 J199.4 J200.4 J201.4 J202.4 J203.4 J204.4 J205.4 J206.4 J207.4 J208.4 J209.4 J210.4 J211.4 J212.4 J213.4 J214.4 J215.4 J216.4 J217.4 J218.4 J219.4 J220.4 J221.4 J222.4 J223.4 J224.4 J225.4 J226.4 J227.4 J228.4 J229.4 J230.4 J231.4 J232.4 J233.4 J234.4 J235.4 J236.4 J237.4 J238.4 J239.4 J240.4 J241.4 J242.4 J243.4 J244.4 J245.4 J246.4 J247.4 J248.4 J249.4 J250.4 J251.4 J252.4 J253.4 J254.4 J255.4 J256.4 JP1.2 JP2.4 JP3.2 JP4.4 ONLINE/OFFLINE.3(S) TER_CONN.2_1 TER_CONN.2_2 TER_CONN.2_3 TER_CONN.2_4 U$4.1(GND) U$4.2(GND) U$4.47(GND) U$4.48(GND) U$4.89(GND) U$4.90(GND) U$4.91(GND) U$4.92(GND) U$5.P$1(GND) U$5.P$2(GND) U$5.P$3(GND) U$5.P$4(GND) U$5.P$5(GND) U$5.P$6(GND) U$5.P$8(GND) U$5.P$27(GND) U$5.P$30(GND) U$5.P$31(GND) U$5.P$32(GND) U$5.P$33(GND) U$5.P$44(GND) U$5.P$45(GND) U$5.P$46(GND) U$5.P$47(GND) U$5.P$48(GND) U$6.GND U$7.GND U$7.GND1(GND) U$7.GND2(GND) U$8.GND U$8.GND1(GND) U$8.GND2(GND) U$9.GND U$9.GND1(GND) U$9.GND2(GND) U$10.GND U$10.GND1(GND) U$10.GND2(GND)
MODE: JP2.8 JP4.8 U$5.MODE
N$1: J1.3 J2.2
N$2: J2.3 J3.2
N$3: J3.3 J4.2
N$4: J5.3 J6.2
N$5: J6.3 J7.2
N$6: J7.3 J8.2
N$7: J4.3 J5.2
N$8: J9.3 J10.2
N$9: J10.3 J11.2
N$10: J11.3 J12.2
N$11: J13.3 J14.2
N$12: J14.3 J15.2
N$13: J15.3 J16.2
N$14: J12.3 J13.2
N$15: J17.3 J18.2
N$16: J18.3 J19.2
N$17: J19.3 J20.2
N$18: J21.3 J22.2
N$19: J22.3 J23.2
N$20: J23.3 J24.2
N$21: J20.3 J21.2
N$22: J25.3 J26.2
N$23: J26.3 J27.2
N$24: J27.3 J28.2
N$25: J29.3 J30.2
N$26: J30.3 J31.2
N$27: J31.3 J32.2
N$28: J28.3 J29.2
N$29: J8.3 J9.2
N$30: J16.3 J17.2
N$31: J24.3 J25.2
N$32: J65.3 J66.2
N$33: J33.3 J34.2
N$34: J34.3 J35.2
N$35: J35.3 J36.2
N$36: J37.3 J38.2
N$37: J38.3 J39.2
N$38: J39.3 J40.2
N$39: J36.3 J37.2
N$40: J41.3 J42.2
N$41: J42.3 J43.2
N$42: J43.3 J44.2
N$43: J45.3 J46.2
N$44: J46.3 J47.2
N$45: J47.3 J48.2
N$46: J44.3 J45.2
N$47: J49.3 J50.2
N$48: J50.3 J51.2
N$49: J51.3 J52.2
N$50: J53.3 J54.2
N$51: J54.3 J55.2
N$52: J55.3 J56.2
N$53: J52.3 J53.2
N$54: J57.3 J58.2
N$55: J58.3 J59.2
N$56: J59.3 J60.2
N$57: J61.3 J62.2
N$58: J62.3 J63.2
N$59: J63.3 J64.2
N$60: J60.3 J61.2
N$61: J40.3 J41.2
N$62: J48.3 J49.2
N$63: J56.3 J57.2
N$64: Q2.2(S) R3.2 R28.2 R29.2 U$10.V-DROP
N$65: J66.3 J67.2
N$66: J67.3 J68.2
N$67: J69.3 J70.2
N$68: J70.3 J71.2
N$69: J71.3 J72.2
N$70: J68.3 J69.2
N$71: J73.3 J74.2
N$72: J74.3 J75.2
N$73: J75.3 J76.2
N$74: J77.3 J78.2
N$75: J78.3 J79.2
N$76: J79.3 J80.2
N$77: J76.3 J77.2
N$78: J81.3 J82.2
N$79: J82.3 J83.2
N$80: J83.3 J84.2
N$81: J85.3 J86.2
N$82: J86.3 J87.2
N$83: J87.3 J88.2
N$84: J84.3 J85.2
N$85: J89.3 J90.2
N$86: J90.3 J91.2
N$87: J91.3 J92.2
N$88: J93.3 J94.2
N$89: J94.3 J95.2
N$90: J95.3 J96.2
N$91: J92.3 J93.2
N$92: J72.3 J73.2
N$93: J80.3 J81.2
N$94: J88.3 J89.2
N$95: J97.3 J98.2
N$96: J98.3 J99.2
N$97: J99.3 J100.2
N$98: J101.3 J102.2
N$99: J102.3 J103.2
N$100: J103.3 J104.2
N$101: J100.3 J101.2
N$102: J105.3 J106.2
N$103: J106.3 J107.2
N$104: J107.3 J108.2
N$105: J109.3 J110.2
N$106: J110.3 J111.2
N$107: J111.3 J112.2
N$108: J108.3 J109.2
N$109: J113.3 J114.2
N$110: J114.3 J115.2
N$111: J115.3 J116.2
N$112: J117.3 J118.2
N$113: J118.3 J119.2
N$114: J119.3 J120.2
N$115: J116.3 J117.2
N$116: J121.3 J122.2
N$117: J122.3 J123.2
N$118: J123.3 J124.2
N$119: J125.3 J126.2
N$120: J126.3 J127.2
N$121: J127.3 J128.2
N$122: J124.3 J125.2
N$123: J104.3 J105.2
N$124: J112.3 J113.2
N$125: J120.3 J121.2
N$126: Q2.1(G) U$10.G
N$127: J129.3 J130.2
N$128: J130.3 J131.2
N$129: J131.3 J132.2
N$130: J133.3 J134.2
N$131: J134.3 J135.2
N$132: J135.3 J136.2
N$133: J132.3 J133.2
N$134: J137.3 J138.2
N$135: J138.3 J139.2
N$136: J139.3 J140.2
N$137: J141.3 J142.2
N$138: J142.3 J143.2
N$139: J143.3 J144.2
N$140: J140.3 J141.2
N$141: J145.3 J146.2
N$142: J146.3 J147.2
N$143: J147.3 J148.2
N$144: J149.3 J150.2
N$145: J150.3 J151.2
N$146: J151.3 J152.2
N$147: J148.3 J149.2
N$148: J153.3 J154.2
N$149: J154.3 J155.2
N$150: J155.3 J156.2
N$151: J157.3 J158.2
N$152: J158.3 J159.2
N$153: J159.3 J160.2
N$154: J156.3 J157.2
N$155: J136.3 J137.2
N$156: J144.3 J145.2
N$157: J152.3 J153.2
N$158: J161.3 J162.2
N$159: J162.3 J163.2
N$160: J163.3 J164.2
N$161: J165.3 J166.2
N$162: J166.3 J167.2
N$163: J167.3 J168.2
N$164: J164.3 J165.2
N$165: J169.3 J170.2
N$166: J170.3 J171.2
N$167: J171.3 J172.2
N$168: J173.3 J174.2
N$169: J174.3 J175.2
N$170: J175.3 J176.2
N$171: J172.3 J173.2
N$172: J177.3 J178.2
N$173: J178.3 J179.2
N$174: J179.3 J180.2
N$175: J181.3 J182.2
N$176: J182.3 J183.2
N$177: J183.3 J184.2
N$178: J180.3 J181.2
N$179: J185.3 J186.2
N$180: J186.3 J187.2
N$181: J187.3 J188.2
N$182: J189.3 J190.2
N$183: J190.3 J191.2
N$184: J191.3 J192.2
N$185: J188.3 J189.2
N$186: J168.3 J169.2
N$187: J176.3 J177.2
N$188: J184.3 J185.2
N$189: Q3.2(S) R7.2 R30.2 R31.2 U$9.V-DROP
N$190: J193.3 J194.2
N$191: J194.3 J195.2
N$192: J195.3 J196.2
N$193: J197.3 J198.2
N$194: J198.3 J199.2
N$195: J199.3 J200.2
N$196: J196.3 J197.2
N$197: J201.3 J202.2
N$198: J202.3 J203.2
N$199: J203.3 J204.2
N$200: J205.3 J206.2
N$201: J206.3 J207.2
N$202: J207.3 J208.2
N$203: J204.3 J205.2
N$204: J209.3 J210.2
N$205: J210.3 J211.2
N$206: J211.3 J212.2
N$207: J213.3 J214.2
N$208: J214.3 J215.2
N$209: J215.3 J216.2
N$210: J212.3 J213.2
N$211: J217.3 J218.2
N$212: J218.3 J219.2
N$213: J219.3 J220.2
N$214: J221.3 J222.2
N$215: J222.3 J223.2
N$216: J223.3 J224.2
N$217: J220.3 J221.2
N$218: J200.3 J201.2
N$219: J208.3 J209.2
N$220: J216.3 J217.2
N$221: J225.3 J226.2
N$222: J226.3 J227.2
N$223: J227.3 J228.2
N$224: J229.3 J230.2
N$225: J230.3 J231.2
N$226: J231.3 J232.2
N$227: J228.3 J229.2
N$228: J233.3 J234.2
N$229: J234.3 J235.2
N$230: J235.3 J236.2
N$231: J237.3 J238.2
N$232: J238.3 J239.2
N$233: J239.3 J240.2
N$234: J236.3 J237.2
N$235: J241.3 J242.2
N$236: J242.3 J243.2
N$237: J243.3 J244.2
N$238: J245.3 J246.2
N$239: J246.3 J247.2
N$240: J247.3 J248.2
N$241: J244.3 J245.2
N$242: J249.3 J250.2
N$243: J250.3 J251.2
N$244: J251.3 J252.2
N$245: J253.3 J254.2
N$246: J254.3 J255.2
N$247: J255.3 J256.2
N$248: J252.3 J253.2
N$249: J232.3 J233.2
N$250: J240.3 J241.2
N$251: J248.3 J249.2
N$252: Q3.1(G) U$9.G
N$253: Q8.1(G) U$7.G
N$254: Q6.1(G) U$8.G
N$265: Q6.2(S) R14.2 R32.2 R33.2 U$8.V-DROP
N$267: Q8.2(S) R27.2 R34.2 R35.2 U$7.V-DROP
RX: JP1.4 JP3.4
SOUND: JP1.5 JP3.5 U$4.85(AIN0) U$5.SOUND
STREAMING: JP2.6 JP4.6 ONLINE/OFFLINE.2(P) U$5.STEAMING(STREAMING)
TX: JP1.3 JP3.3
V+: C1.+ C2.+ C3.+ C4.+ J1.1 J2.1 J3.1 J4.1 J5.1 J6.1 J7.1 J8.1 J9.1 J10.1 J11.1 J12.1 J13.1 J14.1 J15.1 J16.1 J17.1 J18.1 J19.1 J20.1 J21.1 J22.1 J23.1 J24.1 J25.1 J26.1 J27.1 J28.1 J29.1 J30.1 J31.1 J32.1 J33.1 J34.1 J35.1 J36.1 J37.1 J38.1 J39.1 J40.1 J41.1 J42.1 J43.1 J44.1 J45.1 J46.1 J47.1 J48.1 J49.1 J50.1 J51.1 J52.1 J53.1 J54.1 J55.1 J56.1 J57.1 J58.1 J59.1 J60.1 J61.1 J62.1 J63.1 J64.1 J65.1 J66.1 J67.1 J68.1 J69.1 J70.1 J71.1 J72.1 J73.1 J74.1 J75.1 J76.1 J77.1 J78.1 J79.1 J80.1 J81.1 J82.1 J83.1 J84.1 J85.1 J86.1 J87.1 J88.1 J89.1 J90.1 J91.1 J92.1 J93.1 J94.1 J95.1 J96.1 J97.1 J98.1 J99.1 J100.1 J101.1 J102.1 J103.1 J104.1 J105.1 J106.1 J107.1 J108.1 J109.1 J110.1 J111.1 J112.1 J113.1 J114.1 J115.1 J116.1 J117.1 J118.1 J119.1 J120.1 J121.1 J122.1 J123.1 J124.1 J125.1 J126.1 J127.1 J128.1 J129.1 J130.1 J131.1 J132.1 J133.1 J134.1 J135.1 J136.1 J137.1 J138.1 J139.1 J140.1 J141.1 J142.1 J143.1 J144.1 J145.1 J146.1 J147.1 J148.1 J149.1 J150.1 J151.1 J152.1 J153.1 J154.1 J155.1 J156.1 J157.1 J158.1 J159.1 J160.1 J161.1 J162.1 J163.1 J164.1 J165.1 J166.1 J167.1 J168.1 J169.1 J170.1 J171.1 J172.1 J173.1 J174.1 J175.1 J176.1 J177.1 J178.1 J179.1 J180.1 J181.1 J182.1 J183.1 J184.1 J185.1 J186.1 J187.1 J188.1 J189.1 J190.1 J191.1 J192.1 J193.1 J194.1 J195.1 J196.1 J197.1 J198.1 J199.1 J200.1 J201.1 J202.1 J203.1 J204.1 J205.1 J206.1 J207.1 J208.1 J209.1 J210.1 J211.1 J212.1 J213.1 J214.1 J215.1 J216.1 J217.1 J218.1 J219.1 J220.1 J221.1 J222.1 J223.1 J224.1 J225.1 J226.1 J227.1 J228.1 J229.1 J230.1 J231.1 J232.1 J233.1 J234.1 J235.1 J236.1 J237.1 J238.1 J239.1 J240.1 J241.1 J242.1 J243.1 J244.1 J245.1 J246.1 J247.1 J248.1 J249.1 J250.1 J251.1 J252.1 J253.1 J254.1 J255.1 J256.1 Q2.3(D) Q3.3(D) Q6.3(D) Q8.3(D) TER_CONN.1_1 TER_CONN.1_2 TER_CONN.1_3 TER_CONN.1_4
XOUT: JP1.12 JP3.12 U$4.86(AIN1) U$5.XOUT
YOUT: JP1.11 JP3.11 U$4.84(AIN3) U$5.YOUT
ZOUT: JP1.6 JP3.6 U$4.82(AIN5) U$5.ZOUT
Unconnected: J64.3 J128.3 J192.3 J256.3 ONLINE/OFFLINE.1(O) U$2.P$1 U$3.P$1 U$4.3(GPIO1_6) U$4.4(GPIO1_7) U$4.5(GPIO1_2) U$4.6(GPIO1_3) U$4.7(TIMER4) U$4.8(TIMER7) U$4.9(TIMER5) U$4.10(TIMER6) U$4.11(GPIO1_13) U$4.12(GPIO1_12) U$4.13(EHRPWM2B) U$4.14(GPIO0_26) U$4.15(GPIO1_15) U$4.16(GPIO1_14) U$4.17(GPIO0_27) U$4.18(GPIO2_1) U$4.19(EHRPWM2A) U$4.20(GPIO1_31) U$4.21(GPIO1_30) U$4.22(GPIO1_5) U$4.23(GPIO1_4) U$4.24(GPIO1_1) U$4.25(GPIO1_0) U$4.26(GPIO1_29) U$4.27(GPIO2_22) U$4.28(GPIO2_24) U$4.29(GPIO2_23) U$4.30(GPIO2_25) U$4.31(UART5_CTSN) U$4.32(UART5_RTSN) U$4.33(UART4_RTSN) U$4.34(UART3_RTSN) U$4.35(UART4_CTSN) U$4.36(UART3_CTSN) U$4.37(UART5_TXD) U$4.38(UART5_RXD) U$4.54(SYS_5V) U$4.55(PWR_BUT) U$4.56(SYS_RESETN) U$4.57(UART4_RXD) U$4.58(GPIO1_28) U$4.59(UART4_TXD) U$4.60(EHRPWM1A) U$4.61(GPIO1_16) U$4.62(EHRPWM1B) U$4.63(I2C1_SCL) U$4.64(I2C1_SDA) U$4.65(I2C2_SCL) U$4.66(I2C2_SDA) U$4.67(UART2_TXD) U$4.68(UART2_RXD) U$4.69(GPIO1_17) U$4.70(UART1_TXD) U$4.71(GPIO3_21) U$4.72(UART1_RXD) U$4.73(GPIO3_19) U$4.74(SPI1_CS0) U$4.75(SPI1_DO) U$4.76(SPI1_DI) U$4.77(SPI1_SCLK) U$4.78(VDD_ADC) U$4.79(AIN4) U$4.80(GNDA_ADC) U$4.81(AIN6) U$4.87(CLKOUT2) U$4.88(GPIO0_7) U$5.MIC U$5.NC

## Notes on the sheet
- User IO
- JUMPER, NEED TO BE CONNECTED WHEN USE BEAGLEBONE 4 PIN DRIVING

## Power pins joined to a net without a drawn wire
SYS_5V: U$4.53(SYS_5V)

## Library data of the parts
C1-C4 C21 = OPL Eagle Library:C-POLAR*
GOLD_ORB_SM1 = NBitWonder:OSHWLOGO: These are Open-Source Hardware logos.
J1-J256 = OPL Eagle Library:CONNECTOR-HEADER-2X2P
JP1-JP4 = Spark:M12: Header 12 Standard 12-pin 0.1" header. Use with straight break away headers (SKU : PRT-00116), right angle break away headers (PRT-00553), swiss pins (PRT-00743), machine pins (PRT-00117), and female headers (PRT-00115).
JP5 = adafruit:PINHD-2X4: PIN HEADER
ONLINE/OFFLINE = OPL Eagle Library:SWITCH-2P3T-SK12D07VG3: TINY SWITCH ON - ON Source: http://www2.produktinfo.conrad.com/datenblaetter/700000-724999/705152-da-01-de-Subminiaturschalter_TL_36YO.pdf
Q2 Q3 Q6 Q8 = transistor-fet:FDD4141: P-Channel PowerTrench® MOSFET Source: FDD4141.pdf
R3 R7 R14 R27-R35 = OPL Eagle Library:RESISTOR-3W-20MM
TER_CONN = OPL Eagle Library:TERMINAL_CONN
U$1 = OPL Eagle Library:L3D-LOGO
U$2 U$3 = OPL Eagle Library:FIDUCIAL-MARK
U$4 = adafruit:BEAGLEBONE_OUTLINE: Should match A3 pinout - but not completely tested
U$5 = OPL Eagle Library:CUBE-16-DAUGHTERBOARD
U$6 = OPL Eagle Library:CONNECTOR-1X2P-POWER-PAD
U$7-U$10 = OPL Eagle Library:CUBE-16-DAUGHTERBOARD-CURRENT-LMT